# Altium schematic sheet LM-003.SchDoc (part 3 of 3)
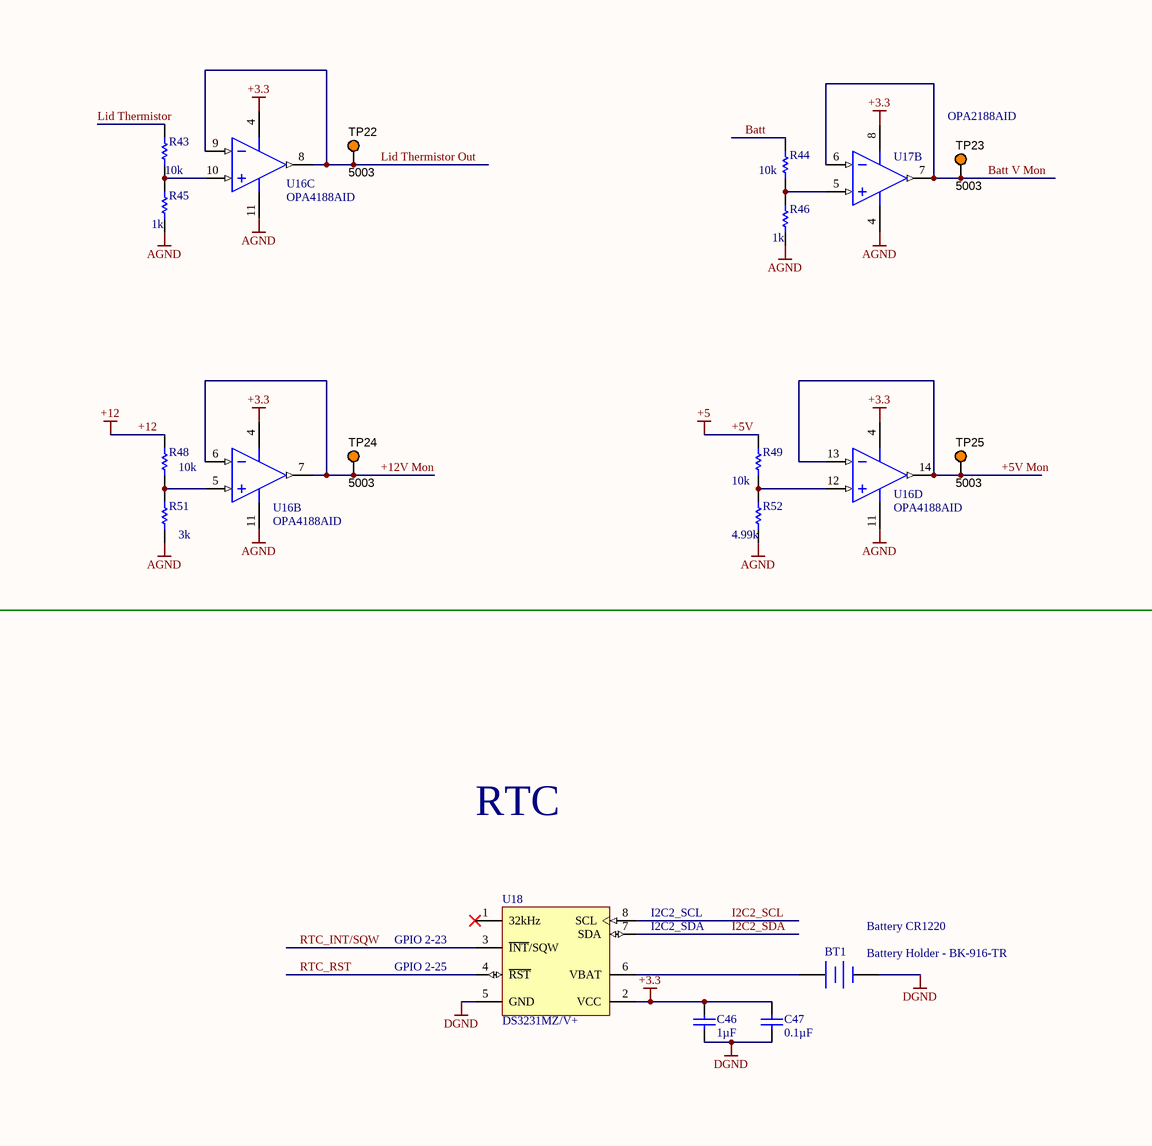
[diagram p10: LM-003.SchDoc, bottom right]

## Library data of the parts (continued)
  R4 R26 R34: Stock 1: 407603
  R15-R18 R20: Stock 1: 406953
R2 = CMP-1013-00017-1: Manufacturer: Vishay Dale; Manufacturer Part Number: CRCW08051K00FKTA; Power (Watts): 0.125W, 1/8W; Temperature Coefficient: ±100ppm/°C; Supplier 1: Digi-Key; Supplier Part Number 1: 541-1.00KAWDKR-ND; RoHS: RoHS non-compliant; Category: Resistors; Stock 1: 57884; Pricing 1: 1=0.14, 10=0.129, 100=0.0496, 1000=0.02183, 2500=0.01885 (USD); Packaging: Digi-Reel®; Part Status: Active; Tolerance: ±1%; Composition: Thick Film; Features: Automotive AEC-Q200; Operating Temperature: -55°C ~ 155°C; Package / Case: 0805 (2012 Metric); Supplier Device Package: 0805; Size / Dimension: 0.079" L x 0.049" W (2.00mm x 1.25mm); Height - Seated (Max): 0.020" (0.50mm); Failure Rate: -; ComponentLink1URL: http://www.vishay.com/docs/20008/dcrcw.pdf; ComponentLink1Description: http://www.vishay.com/docs/20008/dcrcw.pdf
R3 = CMP-1013-00393-1: RES 2K OHM 0.6W 0.1% RADIAL; Manufacturer: Vishay Foil Resistors (Division of Vishay Precision Group); Manufacturer Part Number: Y57872K00000B0L; Temperature Coefficient: ±1ppm/°C; Supplier 1: Digi-Key; Supplier Part Number 1: Y57872K00000B0L-ND; RoHS: RoHS non-compliant; Category: Resistors; Stock 1: 0; Pricing 1: 500=12.12526 (USD); Packaging: Bulk; Part Status: Active; Resistance (Ohms): 2k; Tolerance: ±0.1%; Power (Watts): 0.6W; Composition: Metal Foil; Features: Moisture Resistant, Non-Inductive; Operating Temperature: -55°C ~ 125°C; Package / Case: Radial; Supplier Device Package: -; Size / Dimension: 0.435" L x 0.185" W (11.05mm x 4.70mm); Height - Seated (Max): 0.430" (10.92mm); Failure Rate: -; ComponentLink1URL: http://www.vishaypg.com/docs/63004/vh.pdf; ComponentLink1Description: http://www.vishaypg.com/docs/63004/vh.pdf
R5 = CMP-1013-00017-1: Manufacturer: Vishay Dale; Manufacturer Part Number: CRCW0805280KFKEA; Power (Watts): 0.125W, 1/8W; Temperature Coefficient: ±100ppm/°C; Supplier 1: Digi-Key; Supplier Part Number 1: 541-280KCDKR-ND; RoHS: RoHS Compliant; Category: Resistors; Stock 1: 14771; Pricing 1: 1=0.1, 10=0.044, 100=0.0178, 1000=0.00802, 2500=0.00696 (USD); Packaging: Digi-Reel®; Part Status: Active; Tolerance: ±1%; Composition: Thick Film; Features: Automotive AEC-Q200; Operating Temperature: -55°C ~ 155°C; Package / Case: 0805 (2012 Metric); Supplier Device Package: 0805; Size / Dimension: 0.079" L x 0.049" W (2.00mm x 1.25mm); Height - Seated (Max): 0.020" (0.50mm); Failure Rate: -; ComponentLink1URL: http://www.vishay.com/docs/20035/dcrcwe3.pdf; ComponentLink1Description: http://www.vishay.com/docs/20035/dcrcwe3.pdf
R6-R8 = CMP-1013-00017-1: Manufacturer: Vishay Dale; Manufacturer Part Number: CRCW080510K0FKTA; Power (Watts): 0.125W, 1/8W; Temperature Coefficient: ±100ppm/°C; Supplier 1: Digi-Key; Supplier Part Number 1: 541-3016-6-ND; RoHS: RoHS non-compliant; Category: Resistors; Stock 1: 5348; Pricing 1: 1=0.14, 10=0.129, 100=0.0496, 1000=0.02183, 2500=0.01885 (USD); Packaging: Digi-Reel®; Part Status: Active; Tolerance: ±1%; Composition: Thick Film; Features: Automotive AEC-Q200; Operating Temperature: -55°C ~ 155°C; Package / Case: 0805 (2012 Metric); Supplier Device Package: 0805; Size / Dimension: 0.079" L x 0.049" W (2.00mm x 1.25mm); Height - Seated (Max): 0.020" (0.50mm); Failure Rate: -; ComponentLink1URL: http://www.vishay.com/docs/20008/dcrcw.pdf; ComponentLink1Description: http://www.vishay.com/docs/20008/dcrcw.pdf
R9 = CMP-1013-00017-1: Manufacturer: Vishay Dale; Manufacturer Part Number: CRCW0805300KFKEA; Power (Watts): 0.125W, 1/8W; Temperature Coefficient: ±100ppm/°C; Supplier 1: Digi-Key; Supplier Part Number 1: 541-300KCDKR-ND; RoHS: RoHS Compliant; Category: Resistors; Stock 1: 22918; Pricing 1: 1=0.1, 10=0.044, 100=0.0178, 1000=0.00802, 2500=0.00696 (USD); Packaging: Digi-Reel®; Part Status: Active; Tolerance: ±1%; Composition: Thick Film; Features: Automotive AEC-Q200; Operating Temperature: -55°C ~ 155°C; Package / Case: 0805 (2012 Metric); Supplier Device Package: 0805; Size / Dimension: 0.079" L x 0.049" W (2.00mm x 1.25mm); Height - Seated (Max): 0.020" (0.50mm); Failure Rate: -; ComponentLink1URL: http://www.vishay.com/docs/20035/dcrcwe3.pdf; ComponentLink1Description: http://www.vishay.com/docs/20035/dcrcwe3.pdf
R10 = CMP-1013-00017-1: Manufacturer: Vishay Dale; Manufacturer Part Number: CRCW0805100KFKEAHP; Power (Watts): 0.5W, 1/2W; Temperature Coefficient: ±100ppm/°C; Supplier 1: Digi-Key; Supplier Part Number 1: 541-100KTDKR-ND; RoHS: RoHS Compliant; Category: Resistors; Stock 1: 1548; Pricing 1: 1=0.28, 10=0.233, 100=0.0911, 1000=0.03812, 2500=0.03494 (USD); Packaging: Digi-Reel®; Part Status: Active; Tolerance: ±1%; Composition: Thick Film; Features: Automotive AEC-Q200, Pulse Withstanding; Operating Temperature: -55°C ~ 155°C; Package / Case: 0805 (2012 Metric); Supplier Device Package: 0805; Size / Dimension: 0.079" L x 0.049" W (2.00mm x 1.25mm); Height - Seated (Max): 0.020" (0.50mm); Failure Rate: -; ComponentLink1URL: http://www.vishay.com/docs/20043/crcwhpe3.pdf; ComponentLink1Description: http://www.vishay.com/docs/20043/crcwhpe3.pdf
R11 = CMP-1013-00017-1: Manufacturer: Vishay Dale; Manufacturer Part Number: CRCW080518K2FKEA; Power (Watts): 0.125W, 1/8W; Temperature Coefficient: ±100ppm/°C; Supplier 1: Digi-Key; Supplier Part Number 1: 541-18.2KCDKR-ND; RoHS: RoHS Compliant; Category: Resistors; Stock 1: 12440; Pricing 1: 1=0.1, 10=0.044, 100=0.0178, 1000=0.00802, 2500=0.00696 (USD); Packaging: Digi-Reel®; Part Status: Active; Tolerance: ±1%; Composition: Thick Film; Features: Automotive AEC-Q200; Operating Temperature: -55°C ~ 155°C; Package / Case: 0805 (2012 Metric); Supplier Device Package: 0805; Size / Dimension: 0.079" L x 0.049" W (2.00mm x 1.25mm); Height - Seated (Max): 0.020" (0.50mm); Failure Rate: -; ComponentLink1URL: http://www.vishay.com/docs/20035/dcrcwe3.pdf; ComponentLink1Description: http://www.vishay.com/docs/20035/dcrcwe3.pdf
R12 = CMP-1013-00017-1: Manufacturer: Vishay Dale; Manufacturer Part Number: CRCW08054K70FKEA; Power (Watts): 0.125W, 1/8W; Temperature Coefficient: ±100ppm/°C; Supplier 1: Digi-Key; Supplier Part Number 1: 541-4.70KCDKR-ND; RoHS: RoHS Compliant; Category: Resistors; Stock 1: 0; Pricing 1: 1=0.1, 10=0.044, 100=0.0178, 1000=0.00802, 2500=0.00696 (USD); Packaging: Digi-Reel®; Part Status: Active; Tolerance: ±1%; Composition: Thick Film; Features: Automotive AEC-Q200; Operating Temperature: -55°C ~ 155°C; Package / Case: 0805 (2012 Metric); Supplier Device Package: 0805; Size / Dimension: 0.079" L x 0.049" W (2.00mm x 1.25mm); Height - Seated (Max): 0.020" (0.50mm); Failure Rate: -; ComponentLink1URL: http://www.vishay.com/docs/20035/dcrcwe3.pdf; ComponentLink1Description: http://www.vishay.com/docs/20035/dcrcwe3.pdf
R13 = CMP-1013-00017-1: Manufacturer: Vishay Dale; Manufacturer Part Number: CRCW0805511KFKEA; Power (Watts): 0.125W, 1/8W; Temperature Coefficient: ±100ppm/°C; Supplier 1: Digi-Key; Supplier Part Number 1: 541-511KCDKR-ND; RoHS: RoHS Compliant; Category: Resistors; Stock 1: 39; Pricing 1: 1=0.1, 10=0.044, 100=0.0178, 1000=0.00802, 2500=0.00696 (USD); Packaging: Digi-Reel®; Part Status: Active; Tolerance: ±1%; Composition: Thick Film; Features: Automotive AEC-Q200; Operating Temperature: -55°C ~ 155°C; Package / Case: 0805 (2012 Metric); Supplier Device Package: 0805; Size / Dimension: 0.079" L x 0.049" W (2.00mm x 1.25mm); Height - Seated (Max): 0.020" (0.50mm); Failure Rate: -; ComponentLink1URL: http://www.vishay.com/docs/20035/dcrcwe3.pdf; ComponentLink1Description: http://www.vishay.com/docs/20035/dcrcwe3.pdf
R14 = CMP-1013-00017-1: Manufacturer: Vishay Dale; Manufacturer Part Number: CRCW080533K0FKEAHP; Power (Watts): 0.5W, 1/2W; Temperature Coefficient: ±100ppm/°C; Supplier 1: Digi-Key; Supplier Part Number 1: 541-33.0KTDKR-ND; RoHS: RoHS Compliant; Category: Resistors; Stock 1: 4835; Pricing 1: 1=0.28, 10=0.233, 100=0.0911, 1000=0.03812, 2500=0.03494 (USD); Packaging: Digi-Reel®; Part Status: Active; Tolerance: ±1%; Composition: Thick Film; Features: Automotive AEC-Q200, Pulse Withstanding; Operating Temperature: -55°C ~ 155°C; Package / Case: 0805 (2012 Metric); Supplier Device Package: 0805; Size / Dimension: 0.079" L x 0.049" W (2.00mm x 1.25mm); Height - Seated (Max): 0.020" (0.50mm); Failure Rate: -; ComponentLink1URL: http://www.vishay.com/docs/20043/crcwhpe3.pdf; ComponentLink1Description: http://www.vishay.com/docs/20043/crcwhpe3.pdf
R19 = CMP-1013-00017-1: Manufacturer: Vishay; Manufacturer Part Number: CRCW0805100KFKEA; Temperature Coefficient: 100ppm/°C; Power Rating: 125mW; Voltage Rating: 150V; Supplier 1: Avnet; Supplier Part Number 1: CRCW0805100KFKEA/BKN; Stock 1: 1317; Pricing 1: 1=0.1, 10=0.049, 25=0.042, 50=0.035, 100=0.028 (USD); Mount: Surface Mount; Case/Package: 0805; Number of Pins: 2; Weight: 0.000194oz; Contact Plating: Tin; Case Code (Imperial): 0805; Case Code (Metric): 2012; Min Operating Temperature: -55°C; Max Operating Temperature: 155°C; Tolerance: 1%; Composition: Thick Film; Termination: SMD/SMT; Packaging: Tape and Reel; Package Quantity: 5000; Military Standard: Not; Voltage Rating (DC): 150V; Length: 2mm; Height: 0.45mm; Width: 1.25mm; Depth: 1.25mm; Radiation Hardening: No; Lead Free: Lead Free; REACH SVHC: Unknown; ComponentLink1URL: https://datasheet.ciiva.com/11809/0900766b80d98b26-11809057.pdf; ComponentLink1Description: https://datasheet.ciiva.com/11809/0900766b80d98b26-11809057.pdf; ComponentLink2URL: https://datasheet.ciiva.com/7777/1697337-7777349.pdf; ComponentLink2Description: https://datasheet.ciiva.com/7777/1697337-7777349.pdf; ComponentLink3URL: https://datasheet.ciiva.com/3258/dcrcwe3-3258006.pdf; ComponentLink3Description: https://datasheet.ciiva.com/3258/dcrcwe3-3258006.pdf; ComponentLink4URL: https://datasheet.ciiva.com/16754/70201119-16754822.pdf; ComponentLink4Description: https://datasheet.ciiva.com/16754/70201119-16754822.pdf; ComponentLink5URL: https://datasheet.ciiva.com/8337/dcrcwe3-8337738.pdf; ComponentLink5Description: https://datasheet.ciiva.com/8337/dcrcwe3-8337738.pdf; ComponentLink6URL: https://datasheet.ciiva.com/16341/dcrcwe3-16341530.pdf; ComponentLink6Description: https://datasheet.ciiva.com/16341/dcrcwe3-16341530.pdf; ComponentLink7URL: https://datasheet.ciiva.com/16852/dcrcwe3-16852810.pdf; ComponentLink7Description: https://datasheet.ciiva.com/16852/dcrcwe3-16852810.pdf; ComponentLink8URL: https://datasheet.ciiva.com/16720/70201119-16720891.pdf; ComponentLink8Description: https://datasheet.ciiva.com/16720/70201119-16720891.pdf; ComponentLink9URL: https://datasheet.ciiva.com/7777/1720486-7777565.pdf; ComponentLink9Description: https://datasheet.ciiva.com/7777/1720486-7777565.pdf
R21 R22 = CMP-1013-00574-1: Manufacturer: Vishay Dale; Manufacturer Part Number: CRCW08054K70FKEA; Power (Watts): 0.125W, 1/8W; Temperature Coefficient: ±100ppm/°C; Supplier 1: Digi-Key; Supplier Part Number 1: 541-4.70KCDKR-ND; RoHS: RoHS Compliant; Category: Resistors; Stock 1: 0; Pricing 1: 1=0.1, 10=0.044, 100=0.0178, 1000=0.00802, 2500=0.00696 (USD); Packaging: Digi-Reel®; Part Status: Active; Tolerance: ±1%; Composition: Thick Film; Features: Automotive AEC-Q200; Operating Temperature: -55°C ~ 155°C; Package / Case: 0805 (2012 Metric); Supplier Device Package: 0805; Size / Dimension: 0.079" L x 0.049" W (2.00mm x 1.25mm); Height - Seated (Max): 0.020" (0.50mm); Failure Rate: -; ComponentLink1URL: http://www.vishay.com/docs/20035/dcrcwe3.pdf; ComponentLink1Description: http://www.vishay.com/docs/20035/dcrcwe3.pdf
R23 R30 = CMP-1013-00606-1: Manufacturer: Vishay Dale; Manufacturer Part Number: CRCW08053K90JNEA; Power (Watts): 0.125W, 1/8W; Temperature Coefficient: ±200ppm/°C; Supplier 1: Digi-Key; Supplier Part Number 1: 541-3.9KADKR-ND; RoHS: RoHS Compliant; Category: Resistors; Stock 1: 20963; Pricing 1: 1=0.1, 10=0.028, 100=0.0114, 1000=0.00513, 2500=0.00445 (USD); Packaging: Digi-Reel®; Part Status: Active; Tolerance: ±5%; Composition: Thick Film; Features: Automotive AEC-Q200; Operating Temperature: -55°C ~ 155°C; Package / Case: 0805 (2012 Metric); Supplier Device Package: 0805; Size / Dimension: 0.079" L x 0.049" W (2.00mm x 1.25mm); Height - Seated (Max): 0.020" (0.50mm); Failure Rate: -; ComponentLink1URL: http://www.vishay.com/docs/20035/dcrcwe3.pdf; ComponentLink1Description: http://www.vishay.com/docs/20035/dcrcwe3.pdf
R24 R50 R55 R58 R61 R63 R64 = CMP-1013-00606-1: 6K98 0.125W 1% 0805 (2012 Metric)  SMD; Manufacturer: Vishay Dale; Manufacturer Part Number: CRCW08056K98FKEA; Power (Watts): 0.125W, 1/8W; Temperature Coefficient: ±100ppm/°C; Supplier 1: Digi-Key; Supplier Part Number 1: 541-6.98KCCT-ND; RoHS: RoHS Compliant; Category: Resistors; Stock 1: 34245; Pricing 1: 1=0.1, 10=0.044, 100=0.0178, 1000=0.00802, 2500=0.00696 (USD); Packaging: Cut Tape (CT); Part Status: Active; Tolerance: ±1%; Composition: Thick Film; Features: Automotive AEC-Q200; Operating Temperature: -55°C ~ 155°C; Package / Case: 0805 (2012 Metric); Supplier Device Package: 0805; Size / Dimension: 0.079" L x 0.049" W (2.00mm x 1.25mm); Height - Seated (Max): 0.020" (0.50mm); Failure Rate: -; ComponentLink1URL: http://www.vishay.com/docs/20035/dcrcwe3.pdf; ComponentLink1Description: http://www.vishay.com/docs/20035/dcrcwe3.pdf
R25 R29 = CMP-1013-00606-1: Manufacturer: Vishay Dale; Manufacturer Part Number: CRCW08057K50FKEA; Power (Watts): 0.125W, 1/8W; Temperature Coefficient: ±100ppm/°C; Supplier 1: Digi-Key; Supplier Part Number 1: 541-7.50KCDKR-ND; RoHS: RoHS Compliant; Category: Resistors; Stock 1: 0; Pricing 1: 1=0.1, 10=0.044, 100=0.0178, 1000=0.00802, 2500=0.00696 (USD); Packaging: Digi-Reel®; Part Status: Active; Tolerance: ±1%; Composition: Thick Film; Features: Automotive AEC-Q200; Operating Temperature: -55°C ~ 155°C; Package / Case: 0805 (2012 Metric); Supplier Device Package: 0805; Size / Dimension: 0.079" L x 0.049" W (2.00mm x 1.25mm); Height - Seated (Max): 0.020" (0.50mm); Failure Rate: -; ComponentLink1URL: http://www.vishay.com/docs/20035/dcrcwe3.pdf; ComponentLink1Description: http://www.vishay.com/docs/20035/dcrcwe3.pdf
R27 = CMP-1013-00017-1: RES SMD 0.0 OHM JUMPER 1/8W 0805; Manufacturer: Vishay Dale; Manufacturer Part Number: CRCW08050000Z0EA; Resistance (Ohms): 0.0; Power (Watts): 0.125W, 1/8W; Supplier 1: Digi-Key; Supplier Part Number 1: 541-0.0ADKR-ND; RoHS: RoHS Compliant; Category: Resistors; Stock 1: 407603; Pricing 1: 1=0.1, 10=0.026, 25=0.0184, 50=0.014, 100=0.0104, 250=0.00792, 500=0.00634, 1000=0.00466 (USD); Packaging: Digi-Reel®; Part Status: Active; Tolerance: Jumper; Composition: Thick Film; Features: Automotive AEC-Q200; Temperature Coefficient: -; Operating Temperature: -55°C ~ 155°C; Package / Case: 0805 (2012 Metric); Supplier Device Package: 0805; Size / Dimension: 0.079" L x 0.049" W (2.00mm x 1.25mm); Height - Seated (Max): 0.020" (0.50mm); Failure Rate: -; ComponentLink1URL: http://www.vishay.com/docs/20035/dcrcwe3.pdf; ComponentLink1Description: http://www.vishay.com/docs/20035/dcrcwe3.pdf
R28 = RES1, CENTER TAP: TRIMMER 5K OHM 0.25W PC PIN; Manufacturer 1: Vishay Foil Resistors (Division of Vishay Precision Group); Manufacturer Part Number 1: Y00535K00000J0L; Category 1: Potentiometers, Variable Resistors; Power (Watts): 0.25W, 1/4W; Tolerance: ±5%; Number of Turns: 21; Adjustment Type: Side Adjustment; Resistive Material: Metal Foil; Supplier 1: Digi-Key; Supplier Part Number 1: 804-1020-ND; RoHS 1: RoHS Compliant; Description 1: TRIMMER 5K OHM 0.25W PC PIN; Stock 1: 679; Pricing 1: 1=34.42, 10=32.265, 25=26.5292, 50=22.944, 100=22.227, 250=20.793, 500=19.2156 (USD); Packaging: Bulk; Part Status: Active; Resistance (Ohms): 5k; Mounting Type: Through Hole; Termination Style: PC Pins; Size / Dimension: Rectangular - 0.250" x 0.175" Face x 0.250" L (6.35mm x 4.45mm x 6.35mm); ComponentLink1URL: http://www.vishaypg.com/docs/63053/1240.pdf; ComponentLink1Description: http://www.vishaypg.com/docs/63053/1240.pdf
R31 R32 = CMP-1013-00606-1: Manufacturer: Vishay Dale; Manufacturer Part Number: CRCW08051M00FKEA; Power (Watts): 0.125W, 1/8W; Temperature Coefficient: ±100ppm/°C; Supplier 1: Digi-Key; Supplier Part Number 1: 541-1.00MCDKR-ND; RoHS: RoHS Compliant; Category: Resistors; Stock 1: 44065; Pricing 1: 1=0.1, 10=0.044, 100=0.0178, 1000=0.00802, 2500=0.00696 (USD); Packaging: Digi-Reel®; Part Status: Active; Tolerance: ±1%; Composition: Thick Film; Features: Automotive AEC-Q200; Operating Temperature: -55°C ~ 155°C; Package / Case: 0805 (2012 Metric); Supplier Device Package: 0805; Size / Dimension: 0.079" L x 0.049" W (2.00mm x 1.25mm); Height - Seated (Max): 0.020" (0.50mm); Failure Rate: -; ComponentLink1URL: http://www.vishay.com/docs/20035/dcrcwe3.pdf; ComponentLink1Description: http://www.vishay.com/docs/20035/dcrcwe3.pdf
R33 = CMP-1013-00133-1: 300K 0.125W 5% 0805 (2012 Metric)  SMD; Manufacturer: Vishay Dale; Manufacturer Part Number: CRCW0805300RFKEA; Tolerance: ±1%; Power (Watts): 0.125W, 1/8W; Temperature Coefficient: ±100ppm/°C; Supplier 1: Digi-Key; Supplier Part Number 1: 541-300CCT-ND; RoHS: RoHS Compliant; Category: Resistors; Stock 1: 79765; Pricing 1: 1=0.1, 10=0.044, 100=0.0178, 1000=0.00802, 2500=0.00696 (USD); Packaging: Cut Tape (CT); Part Status: Active; Composition: Thick Film; Features: Automotive AEC-Q200; Operating Temperature: -55°C ~ 155°C; Package / Case: 0805 (2012 Metric); Supplier Device Package: 0805; Size / Dimension: 0.079" L x 0.049" W (2.00mm x 1.25mm); Height - Seated (Max): 0.020" (0.50mm); Failure Rate: -; ComponentLink1URL: http://www.vishay.com/docs/20035/dcrcwe3.pdf; ComponentLink1Description: http://www.vishay.com/docs/20035/dcrcwe3.pdf
R35 = CMP-1013-00017-1: Manufacturer: Vishay; Manufacturer Part Number: CRCW08050000Z0EA; Power Rating: 125mW; Voltage Rating: 150V; Tolerance: 1%; Temperature Coefficient: 100ppm/°C; Supplier 1: Digi-Key; Supplier Part Number 1: 541-0.0ADKR-ND; Stock 1: 415251; Pricing 1: 1=0.1, 10=0.026, 25=0.0184, 50=0.014, 100=0.0104, 250=0.0079, 500=0.0063, 1000=0.0047 (USD); Case/Package: 0805; Weight: 0.000194oz; Contact Plating: Tin,Lead; Case Code (Imperial): 0805; Case Code (Metric): 2012; Min Operating Temperature: -55°C; Max Operating Temperature: 155°C; Composition: Thick Film; Termination: SMD/SMT; Packaging: Tape and Reel; Package Quantity: 1; Number of Terminations: 2; Military Standard: Not; Max Power Dissipation: 125mW; Voltage Rating (DC): 150V; Length: 2mm; Height: 0.45mm; Width: 1.25mm; Depth: 1.25mm; Radiation Hardening: No; Lead Free: Lead Free; REACH SVHC: Unknown; ComponentLink1URL: https://datasheet.ciiva.com/16883/dcrcwe3-16883622.pdf; ComponentLink1Description: https://datasheet.ciiva.com/16883/dcrcwe3-16883622.pdf; ComponentLink2URL: https://datasheet.ciiva.com/26314/fld-crcw-e3-data-en-26314630.pdf; ComponentLink2Description: https://datasheet.ciiva.com/26314/fld-crcw-e3-data-en-26314630.pdf; ComponentLink3URL: https://datasheet.ciiva.com/5543/dcrcwe3-109170-5543096.pdf; ComponentLink3Description: https://datasheet.ciiva.com/5543/dcrcwe3-109170-5543096.pdf; ComponentLink4URL: https://datasheet.ciiva.com/11811/0900766b80d98b26-11811304.pdf; ComponentLink4Description: https://datasheet.ciiva.com/11811/0900766b80d98b26-11811304.pdf; ComponentLink5URL: https://datasheet.ciiva.com/16389/dcrcwe3-16389338.pdf; ComponentLink5Description: https://datasheet.ciiva.com/16389/dcrcwe3-16389338.pdf; ComponentLink6URL: https://datasheet.ciiva.com/16719/70201119-16719706.pdf; ComponentLink6Description: https://datasheet.ciiva.com/16719/70201119-16719706.pdf; ComponentLink7URL: https://datasheet.ciiva.com/2463/dcrcwe3-2463037.pdf; ComponentLink7Description: https://datasheet.ciiva.com/2463/dcrcwe3-2463037.pdf; ComponentLink8URL: https://datasheet.ciiva.com/7841/1697337-7841629.pdf; ComponentLink8Description: https://datasheet.ciiva.com/7841/1697337-7841629.pdf; ComponentLink9URL: https://datasheet.ciiva.com/2463/dcrcwe3-2463038.pdf; ComponentLink9Description: https://datasheet.ciiva.com/2463/dcrcwe3-2463038.pdf; ComponentLink10URL: https://datasheet.ciiva.com/2463/dcrcwe3-2463039.pdf; ComponentLink10Description: https://datasheet.ciiva.com/2463/dcrcwe3-2463039.pdf; ComponentLink11URL: https://datasheet.ciiva.com/7841/1720486-7841839.pdf; ComponentLink11Description: https://datasheet.ciiva.com/7841/1720486-7841839.pdf
R36 = CMP-1013-00017-1: RES SMD 0.0 OHM JUMPER 1/8W 0805; Manufacturer: Vishay; Manufacturer Part Number: CRCW08050000Z0EA; Resistance: 0; Power Rating: 125mW; Voltage Rating: 150V; Tolerance: 1%; Temperature Coefficient: 100ppm/°C; Supplier 1: Digi-Key; Supplier Part Number 1: 541-0.0ADKR-ND; Stock 1: 415251; Pricing 1: 1=0.1, 10=0.026, 25=0.0184, 50=0.014, 100=0.0104, 250=0.0079, 500=0.0063, 1000=0.0047 (USD); Case/Package: 0805; Weight: 0.000194oz; Contact Plating: Tin,Lead; Case Code (Imperial): 0805; Case Code (Metric): 2012; Min Operating Temperature: -55°C; Max Operating Temperature: 155°C; Composition: Thick Film; Termination: SMD/SMT; Packaging: Tape and Reel; Package Quantity: 1; Number of Terminations: 2; Military Standard: Not; Max Power Dissipation: 125mW; Voltage Rating (DC): 150V; Length: 2mm; Height: 0.45mm; Width: 1.25mm; Depth: 1.25mm; Radiation Hardening: No; Lead Free: Lead Free; REACH SVHC: Unknown; ComponentLink1URL: https://datasheet.ciiva.com/16883/dcrcwe3-16883622.pdf; ComponentLink1Description: https://datasheet.ciiva.com/16883/dcrcwe3-16883622.pdf; ComponentLink2URL: https://datasheet.ciiva.com/26314/fld-crcw-e3-data-en-26314630.pdf; ComponentLink2Description: https://datasheet.ciiva.com/26314/fld-crcw-e3-data-en-26314630.pdf; ComponentLink3URL: https://datasheet.ciiva.com/5543/dcrcwe3-109170-5543096.pdf; ComponentLink3Description: https://datasheet.ciiva.com/5543/dcrcwe3-109170-5543096.pdf; ComponentLink4URL: https://datasheet.ciiva.com/11811/0900766b80d98b26-11811304.pdf; ComponentLink4Description: https://datasheet.ciiva.com/11811/0900766b80d98b26-11811304.pdf; ComponentLink5URL: https://datasheet.ciiva.com/16389/dcrcwe3-16389338.pdf; ComponentLink5Description: https://datasheet.ciiva.com/16389/dcrcwe3-16389338.pdf; ComponentLink6URL: https://datasheet.ciiva.com/16719/70201119-16719706.pdf; ComponentLink6Description: https://datasheet.ciiva.com/16719/70201119-16719706.pdf; ComponentLink7URL: https://datasheet.ciiva.com/2463/dcrcwe3-2463037.pdf; ComponentLink7Description: https://datasheet.ciiva.com/2463/dcrcwe3-2463037.pdf; ComponentLink8URL: https://datasheet.ciiva.com/7841/1697337-7841629.pdf; ComponentLink8Description: https://datasheet.ciiva.com/7841/1697337-7841629.pdf; ComponentLink9URL: https://datasheet.ciiva.com/2463/dcrcwe3-2463038.pdf; ComponentLink9Description: https://datasheet.ciiva.com/2463/dcrcwe3-2463038.pdf; ComponentLink10URL: https://datasheet.ciiva.com/2463/dcrcwe3-2463039.pdf; ComponentLink10Description: https://datasheet.ciiva.com/2463/dcrcwe3-2463039.pdf; ComponentLink11URL: https://datasheet.ciiva.com/7841/1720486-7841839.pdf; ComponentLink11Description: https://datasheet.ciiva.com/7841/1720486-7841839.pdf
R37 R43 R44 R48 R49 = CMP-1013-00393-1: Manufacturer: Vishay Dale; Manufacturer Part Number: CRCW080510K0FKTA; Power (Watts): 0.125W, 1/8W; Temperature Coefficient: ±100ppm/°C; Supplier 1: Digi-Key; Supplier Part Number 1: 541-3016-6-ND; RoHS: RoHS non-compliant; Category: Resistors; Stock 1: 4898; Pricing 1: 1=0.14, 10=0.129, 100=0.0496, 1000=0.02183, 2500=0.01885 (USD); Packaging: Digi-Reel®; Part Status: Active; Tolerance: ±1%; Composition: Thick Film; Features: Automotive AEC-Q200; Operating Temperature: -55°C ~ 155°C; Package / Case: 0805 (2012 Metric); Supplier Device Package: 0805; Size / Dimension: 0.079" L x 0.049" W (2.00mm x 1.25mm); Height - Seated (Max): 0.020" (0.50mm); Failure Rate: -; ComponentLink1URL: http://www.vishay.com/docs/20008/dcrcw.pdf; ComponentLink1Description: http://www.vishay.com/docs/20008/dcrcw.pdf
R38 = CMP-1013-00017-1: Manufacturer: Vishay Dale; Manufacturer Part Number: CRCW0805383RFKEA; Power (Watts): 0.125W, 1/8W; Temperature Coefficient: ±100ppm/°C; Supplier 1: Digi-Key; Supplier Part Number 1: 541-383CDKR-ND; RoHS: RoHS Compliant; Category: Resistors; Stock 1: 21887; Pricing 1: 1=0.1, 10=0.044, 100=0.0178, 1000=0.00802, 2500=0.00696 (USD); Packaging: Digi-Reel®; Part Status: Active; Tolerance: ±1%; Composition: Thick Film; Features: Automotive AEC-Q200; Operating Temperature: -55°C ~ 155°C; Package / Case: 0805 (2012 Metric); Supplier Device Package: 0805; Size / Dimension: 0.079" L x 0.049" W (2.00mm x 1.25mm); Height - Seated (Max): 0.020" (0.50mm); Failure Rate: -; ComponentLink1URL: http://www.vishay.com/docs/20035/dcrcwe3.pdf; ComponentLink1Description: http://www.vishay.com/docs/20035/dcrcwe3.pdf
R39 R45 R46 = CMP-1013-00393-1: Manufacturer: Vishay Dale; Manufacturer Part Number: CRCW08051K00FKEA; Power (Watts): 0.125W, 1/8W; Temperature Coefficient: ±100ppm/°C; Supplier 1: Digi-Key; Supplier Part Number 1: 541-1.00KCDKR-ND; RoHS: RoHS Compliant; Category: Resistors; Stock 1: 34392; Pricing 1: 1=0.1, 10=0.044, 100=0.0178, 1000=0.00802, 2500=0.00696 (USD); Packaging: Digi-Reel®; Part Status: Active; Tolerance: ±1%; Composition: Thick Film; Features: Automotive AEC-Q200; Operating Temperature: -55°C ~ 155°C; Package / Case: 0805 (2012 Metric); Supplier Device Package: 0805; Size / Dimension: 0.079" L x 0.049" W (2.00mm x 1.25mm); Height - Seated (Max): 0.020" (0.50mm); Failure Rate: -; ComponentLink1URL: http://www.vishay.com/docs/20035/dcrcwe3.pdf; ComponentLink1Description: http://www.vishay.com/docs/20035/dcrcwe3.pdf
R40 = CMP-1013-00017-1: RES SMD 1K OHM 1% 1/2W 0805; Manufacturer: Vishay Dale; Manufacturer Part Number: CRCW08051K00FKEAHP; Power (Watts): 0.5W, 1/2W; Temperature Coefficient: ±100ppm/°C; Supplier 1: Digi-Key; Supplier Part Number 1: 541-1.00KTDKR-ND; RoHS: RoHS Compliant; Category: Resistors; Stock 1: 64012; Pricing 1: 1=0.28, 10=0.233, 100=0.0911, 1000=0.03812, 2500=0.03494 (USD); Packaging: Digi-Reel®; Part Status: Active; Tolerance: ±1%; Composition: Thick Film; Features: Automotive AEC-Q200, Pulse Withstanding; Operating Temperature: -55°C ~ 155°C; Package / Case: 0805 (2012 Metric); Supplier Device Package: 0805; Size / Dimension: 0.079" L x 0.049" W (2.00mm x 1.25mm); Height - Seated (Max): 0.020" (0.50mm); Failure Rate: -; ComponentLink1URL: http://www.vishay.com/docs/20043/crcwhpe3.pdf; ComponentLink1Description: http://www.vishay.com/docs/20043/crcwhpe3.pdf
R41 R42 = CMP-1013-00393-1: Manufacturer: Vishay Dale; Manufacturer Part Number: CRCW0805100RFKEA; Power (Watts): 0.125W, 1/8W; Temperature Coefficient: ±100ppm/°C; Supplier 1: Digi-Key; Supplier Part Number 1: 541-100CDKR-ND; RoHS: RoHS Compliant; Category: Resistors; Stock 1: 281212; Pricing 1: 1=0.1, 10=0.044, 100=0.0178, 1000=0.00802, 2500=0.00696 (USD); Packaging: Digi-Reel®; Part Status: Active; Tolerance: ±1%; Composition: Thick Film; Features: Automotive AEC-Q200; Operating Temperature: -55°C ~ 155°C; Package / Case: 0805 (2012 Metric); Supplier Device Package: 0805; Size / Dimension: 0.079" L x 0.049" W (2.00mm x 1.25mm); Height - Seated (Max): 0.020" (0.50mm); Failure Rate: -; ComponentLink1URL: http://www.vishay.com/docs/20035/dcrcwe3.pdf; ComponentLink1Description: http://www.vishay.com/docs/20035/dcrcwe3.pdf
R47 R54 R57 R60 R65 = CMP-1013-00393-1: Manufacturer: Vishay Dale; Manufacturer Part Number: CRCW08054K99FKEA; Power (Watts): 0.125W, 1/8W; Temperature Coefficient: ±100ppm/°C; Supplier 1: Digi-Key; Supplier Part Number 1: 541-4.99KCDKR-ND; RoHS: RoHS Compliant; Category: Resistors; Stock 1: 91870; Pricing 1: 1=0.1, 10=0.044, 100=0.0178, 1000=0.00802, 2500=0.00696 (USD); Packaging: Digi-Reel®; Part Status: Active; Tolerance: ±1%; Composition: Thick Film; Features: Automotive AEC-Q200; Operating Temperature: -55°C ~ 155°C; Package / Case: 0805 (2012 Metric); Supplier Device Package: 0805; Size / Dimension: 0.079" L x 0.049" W (2.00mm x 1.25mm); Height - Seated (Max): 0.020" (0.50mm); Failure Rate: -; ComponentLink1URL: http://www.vishay.com/docs/20035/dcrcwe3.pdf; ComponentLink1Description: http://www.vishay.com/docs/20035/dcrcwe3.pdf
R51 = CMP-1013-00393-1: Manufacturer: Vishay Dale; Manufacturer Part Number: CRCW08053K00FKEAHP; Power (Watts): 0.5W, 1/2W; Temperature Coefficient: ±100ppm/°C; Supplier 1: Digi-Key; Supplier Part Number 1: 541-3.00KTDKR-ND; RoHS: RoHS Compliant; Category: Resistors; Stock 1: 4756; Pricing 1: 1=0.28, 10=0.233, 100=0.0911, 1000=0.03812, 2500=0.03494 (USD); Packaging: Digi-Reel®; Part Status: Active; Tolerance: ±1%; Composition: Thick Film; Features: Automotive AEC-Q200, Pulse Withstanding; Operating Temperature: -55°C ~ 155°C; Package / Case: 0805 (2012 Metric); Supplier Device Package: 0805; Size / Dimension: 0.079" L x 0.049" W (2.00mm x 1.25mm); Height - Seated (Max): 0.020" (0.50mm); Failure Rate: -; ComponentLink1URL: http://www.vishay.com/docs/20043/crcwhpe3.pdf; ComponentLink1Description: http://www.vishay.com/docs/20043/crcwhpe3.pdf
R52 = CMP-1013-00393-1: Manufacturer: Vishay Dale; Manufacturer Part Number: CRCW08054K99FKTA; Power (Watts): 0.125W, 1/8W; Temperature Coefficient: ±100ppm/°C; Supplier 1: Digi-Key; Supplier Part Number 1: 541-3030-6-ND; RoHS: RoHS non-compliant; Category: Resistors; Stock 1: 14290; Pricing 1: 1=0.14, 10=0.129, 100=0.0496, 1000=0.02183, 2500=0.01885 (USD); Packaging: Digi-Reel®; Part Status: Active; Tolerance: ±1%; Composition: Thick Film; Features: Automotive AEC-Q200; Operating Temperature: -55°C ~ 155°C; Package / Case: 0805 (2012 Metric); Supplier Device Package: 0805; Size / Dimension: 0.079" L x 0.049" W (2.00mm x 1.25mm); Height - Seated (Max): 0.020" (0.50mm); Failure Rate: -; ComponentLink1URL: http://www.vishay.com/docs/20008/dcrcw.pdf; ComponentLink1Description: http://www.vishay.com/docs/20008/dcrcw.pdf
R53 R56 R59 R62 R66 = CMP-1013-00393-1: Manufacturer: Vishay Dale; Manufacturer Part Number: CRCW080575R0FKEA; Power (Watts): 0.125W, 1/8W; Temperature Coefficient: ±100ppm/°C; Supplier 1: Digi-Key; Supplier Part Number 1: 541-75.0CDKR-ND; RoHS: RoHS Compliant; Category: Resistors; Stock 1: 26396; Pricing 1: 1=0.1, 10=0.044, 100=0.0178, 1000=0.00802, 2500=0.00696 (USD); Packaging: Digi-Reel®; Part Status: Active; Tolerance: ±1%; Composition: Thick Film; Features: Automotive AEC-Q200; Operating Temperature: -55°C ~ 155°C; Package / Case: 0805 (2012 Metric); Supplier Device Package: 0805; Size / Dimension: 0.079" L x 0.049" W (2.00mm x 1.25mm); Height - Seated (Max): 0.020" (0.50mm); Failure Rate: -; ComponentLink1URL: http://www.vishay.com/docs/20035/dcrcwe3.pdf; ComponentLink1Description: http://www.vishay.com/docs/20035/dcrcwe3.pdf
RL1 = Relay-SPDT: RELAY TELECOM SPDT 2A 12V; Manufacturer 1: TE Connectivity Potter & Brumfield Relays; Category 1: Relays; Coil Type: Non Latching; Coil Voltage: 12VDC; Contact Form: SPDT (1 Form C); Switching Voltage: 250VAC, 220VDC - Max; Turn On Voltage (Max): 9 VDC; Turn Off Voltage (Min): 1.2 VDC; Coil Power: 140 mW; Coil Resistance: 1.03 kOhms; Supplier 1: Digi-Key; Supplier Part Number 1: PB1250CT-ND; Manufacturer Part Number 1: 1462042-9; RoHS 1: RoHS Compliant; Description 1: RELAY TELECOM SPDT 2A 12V; Stock 1: 15694; Pricing 1: 1=4.25, 10=3.98, 25=3.5376, 50=3.3608, 100=3.1838, 250=2.94064 (USD); Packaging: Cut Tape (CT); Part Status: Active; Relay Type: Telecom; Features: Sealed - Hermetically; Mounting Type: Surface Mount; Termination Style: Gull Wing; Contact Material: Palladium (Pd), Ruthenium (Ru), Gold (Au); Operating Temperature: -40°C ~ 85°C; ComponentLink1URL: http://www.te.com/commerce/DocumentDelivery/DDEController?Action=srchrtrv&DocNm=1462042-2&DocType=Customer+Drawing&DocLang=English; ComponentLink1Description: http://www.te.com/commerce/DocumentDelivery/DDEController?Action=srchrtrv&DocNm=1462042-2&DocType=Customer+Drawing&DocLang=English
TP1-TP15 TP17-TP25 = CMP-1672-00009-1: Test Point, Orange, 1-Pin THD, RoHS; Peak Reverse Current: 600 uA; Forward Current: 3 A; Max Surge Current: 80 A; Forward Voltage: 1.08 V; Max Operating Temperature: 150 degC; PackageReference: 5003; Pins: 2; ComponentLink2URL: http://keyelco.com/userAssets/file/M65p56.pdf; PackageDescription: 1-Pin Through Hole Device, Dia 2.54 mm; Weight: 0.01 lb; Diameter: 5.3 mm; Mount: Through Hole; Package Quantity: 500; Packaging: Bulk; Min Operating Temperature: -65 degC; ComponentLink1Description: Manufacturer URL; Height: 0.25 inch; ComponentLink1URL: http://www.keyelco.com/; ComponentLink2Description: Datasheet; Width: 0.25 inch; REACH SVHC: No SVHC; RoHSCompliant: true; Radiation Hardening: No; Length: 9.5 mm; DatasheetVersion: Jun-15
TP16 = TESTPOINT A: Manufacturer 1: Keystone Electronics; Manufacturer Part Number 1: 5001; Category 1: Test and Measurement; Plating: Silver; Material - Insulation: Nylon 46, UL 94V-0; Material - Body: Phosphor Bronze; Supplier 1: Digi-Key; Supplier Part Number 1: 36-5001-ND; RoHS 1: RoHS Compliant; Description 1: TEST POINT PC MINI .040"D BLACK; Stock 1: 883882; Pricing 1: 1=0.37, 10=0.316, 50=0.2298, 100=0.2209, 250=0.19832, 500=0.18932, 1000=0.1616, 2500=0.14424, 5000=0.13523 (USD); Packaging: Bulk; Part Status: Active; Type: PC Test Point, Miniature; Mounting Type: 0.040" (1.02mm) Hole Diameter; Color: Black; Size / Dimension: 0.100" Dia x 0.180" L (2.54mm x 4.57mm); Height: -; ComponentLink1URL: http://www.keyelco.com/product-pdf.cfm?p=1310; ComponentLink1Description: http://www.keyelco.com/product-pdf.cfm?p=1310
U1 = BD90GA3WEFJ-E2: IC REG LDO 9V 0.3A 8HTSOP-J; Category 2: Integrated Circuits (ICs); Regulator Topology: Positive Fixed; Current - Output: 300mA; Voltage - Dropout (Typical): 0.6V @ 300mA; Voltage - Input: Up to 14V; Supplier 1: Digi-Key; Supplier Part Number 1: BD90GA3WEFJ-E2DKR-ND; Supplier 2: Digi-Key; Supplier Part Number 2: BD90GA3WEFJ-E2CT-ND; Manufacturer 2: Rohm Semiconductor; Manufacturer Part Number 2: BD90GA3WEFJ-E2; RoHS 2: RoHS Compliant; Description 2: IC REG LDO 9V 0.3A 8HTSOP-J; Stock 2: 4781; Pricing 2: 1=0.69, 10=0.606, 25=0.5364, 100=0.4672, 250=0.40664, 500=0.34608, 1000=0.27686 (USD); Packaging: Cut Tape (CT); Part Status: Active; Voltage - Output: 9V; Current - Limit (Min): -; Operating Temperature: -25°C ~ 85°C; Mounting Type: Surface Mount; Package / Case: 8-SOIC (0.154", 3.90mm Width) Exposed Pad; Supplier Device Package: 8-HTSOP-J; ComponentLink1URL: http://rohmfs.rohm.com/en/products/databook/datasheet/ic/power/linear_regulator/bdxxga3wefj-e.pdf; ComponentLink1Description: http://rohmfs.rohm.com/en/products/databook/datasheet/ic/power/linear_regulator/bdxxga3wefj-e.pdf
U2 = CMP-0491-01698-1: IC REG BOOST ADJ 0.3A TSOT23-6; Manufacturer 1: Linear Technology; Manufacturer Part Number 1: LT3461AES6#TRMPBF; Category 1: Integrated Circuits (ICs); Function: Step-Up; Output Configuration: Positive; Output Type: Adjustable; Number of Outputs: 1; Voltage - Input (Min): 2.5V; Voltage - Input (Max): 16V; Voltage - Output (Min/Fixed): 1.255V; Voltage - Output (Max): 38V; Current - Output: 300mA (Switch); Frequency - Switching: 3MHz; Synchronous Rectifier: No; Supplier 1: Digi-Key; Supplier Part Number 1: LT3461AES6#TRMPBFCT-ND; RoHS 1: RoHS Compliant; Description 1: IC REG BOOST ADJ 0.3A TSOT23-6; Stock 1: 1325; Pricing 1: 1=3.94, 25=3.52, 100=2.4, 250=2.2 (USD); Packaging: Cut Tape (CT); Part Status: Active; Topology: Boost; Operating Temperature: 0°C ~ 70°C (TA); Mounting Type: Surface Mount; Package / Case: SOT-23-6 Thin, TSOT-23-6; Supplier Device Package: TSOT-23-6; ComponentLink1URL: http://www.linear.com/docs/3469; ComponentLink1Description: http://www.linear.com/docs/3469
U3 U5 U16 = OPA4188AID: 0.03 uV/C, Low Noise, Rail-to-Rail Output, Zero-Drift Operational Amplifier, 4 to 36 V, -40 to 125 degC, 14-pin SOIC (D14), Green (RoHS & no Sb/Br); Manufacturer: Texas Instruments; CMRR(Min)(dB): 120; GBW(Typ)(MHz): 2; Iq per channel(Max)(mA): 0.475; Number of Channels: 4; Offset Drift(Typ)(uV/C): 0.03; Packing: TUBE; Rating: Catalog; Slew Rate(Typ)(V/us): 0.8; SubFamily: High Supply Voltage Amplifier (>=30V), Low Noise Amp (<=10nV/rtHz), Low Offset Voltage Amplifier (<=500uV), Low Power Amp (<=500uA), Zero Drift Precision Amplifier; Total Supply Voltage(Max)(+5V is 5, +/-5V is 10): 36; DatasheetVersion: SBOS641B; PackageVersion: 4040047-5/M, 06/2011; PackageReference: D14; PackageDescription: 14-Pin Plastic Small Outline, Body 8.65 x 3.9 mm, Pitch 1.27 mm; Supplier 1: Digi-Key; Supplier Part Number 1: 296-34857-5-ND; Supplier 2: Farnell; Supplier Part Number 2: 2211327; Supplier 3: Newark; Supplier Part Number 3: 44W4374; Supplier 4: Newark; Supplier Part Number 4: 27W9605; Supplier 5: Mouser; Supplier Part Number 5: 595-OPA4188AID; Eco-Plan: Green (RoHS & no Sb/Br); Total Supply Voltage(Min)(+5V is 5, +/-5V is 10): 4; Mounting Technology: Surface Mount; Code_JEDEC: MS-012; PartNumber: OPA4188AID; ComponentLink1Description: Manufacturer URL; ComponentLink1URL: http://www.ti.com/; ComponentLink2Description: Datasheet; ComponentLink2URL: http://www.ti.com/lit/ds/symlink/opa4188.pdf; ComponentLink3Description: Package Specification; ComponentLink3URL: http://www.ti.com/lit/ml/mpds177g/mpds177g.pdf
U4 U14 = CMP-0784-00054-1: Pin Programmable, Precision Voltage Reference, + 2.5 / + 5 / + 7.5 / + 10 Prog V Output, 4.5 to 30 V Supply, Commercial, 8-pin DIP (N-8), Tube; Manufacturer: Analog Devices; Max V Supply (V): 30; Min V Supply (V): 4.5; Ref Out TC (ppm/C): 15; Vout: 2.5V, 5V, 7.5V, 10V; ComponentLink3URL: http:/www.analog.com/static/imported-files/packages/PKG_PDF/PDIP(N)/N_8.pdf; ComponentLink1URL: http://www.analog.com/en/index.html; PartNumber: AD584KNZ; ComponentLink1Description: Manufacturer URL; ComponentLink2Description: Datasheet; PackageDescription: 8-Pin Plastic Dual In-Line Package, Row spacing 7.62 mm, Pitch 2.54 mm; Operating Temp Range: 0 to 70 degC; DatasheetVersion: Rev. C; Code_JEDEC: MS-001; Packing: Tube; ComponentLink3Description: Package Specification; PackageReference: N-8; ComponentLink4Description: URL Link1; Mounting Technology: Through Hole; PackageVersion: 070606-A, 07/2006; ComponentLink4URL: Product URL:http://www.analog.com/en/special-linear-functions/voltage-references/ad584/products/product.html; ComponentLink2URL: http://www.analog.com/static/imported-files/data_sheets/AD584.pdf
U7#1 U7#2 U10#1 U10#2 = CMP-0809-00004-2: Precision, Low Noise, Rail-to-Rail Output, Zero-Drift Operational Amplifier, 4 to 36 V, -40 to 125 degC, 8-pin SOIC (D8), Green (RoHS & no Sb/Br); Manufacturer: Texas Instruments; Iq per channel(Max)(mA): 0.51; SubFamily: Zero Drift Precision Amplifier; Total Supply Voltage(Max)(+5V is 5, +/-5V is 10): 36; CMRR(Min)(dB): 120; Total Supply Voltage(Min)(+5V is 5, +/-5V is 10): 4; Slew Rate(Typ)(V/us): 0.8; GBW(Typ)(MHz): 2; Offset Drift(Typ)(uV/C): 0.03; Number of Channels: 1; Rating: Catalog; Packing: LARGE T&R; ComponentLink2URL: http://www.ti.com/lit/ds/symlink/opa188.pdf; Eco-Plan: Green (RoHS & no Sb/Br); DatasheetVersion: SBOS642A; PartNumber: OPA188AIDR; ComponentLink3Description: Package Specification; PackageDescription: 8-Pin Plastic Small Outline, Body 4.9 x 3.9 mm, Pitch 1.27 mm; Code_JEDEC: MS-012; ComponentLink1Description: Manufacturer URL; PackageReference: D0008A; Mounting Technology: Surface Mount; PackageVersion: 4040047-3/M, 06/2011; ComponentLink3URL: http://www.ti.com/litv/pdf/msoi002j; ComponentLink2Description: Datasheet; ComponentLink1URL: http://www.ti.com/; PartId: 1
U8 = CCG302412S: IC CONV DC-DC 15W DUAL 5V PCB; Manufacturer 1: TDK-Lambda Americas Inc.; Category 1: Power Supplies - Board Mount; Number of Outputs: 2; Voltage - Input (Min): 9V; Voltage - Input (Max): 36V; Voltage - Output 2: -5V; Current - Output (Max): 1.5A, 1.5A; Voltage - Isolation: 1.6kV (1600V); Efficiency: 85%; Supplier 1: Digi-Key; Supplier Part Number 1: 285-1902-ND; Manufacturer Part Number 1: PXB15-24WD05/N; RoHS 1: RoHS Compliant; Description 1: IC CONV DC-DC 15W DUAL 5V PCB; Stock 1: 28; Pricing 1: 1=61.61, 10=59.59 (USD); Packaging: Tube; Part Status: Active; Type: Isolated Module; Voltage - Output 1: 5V; Voltage - Output 3: -; Power (Watts): 15W; Applications: ITE (Commercial); Features: Remote On/Off, OCP, OVP, SCP; Operating Temperature: -40°C ~ 85°C; Mounting Type: Through Hole; Package / Case: 6-DIP Module; Size / Dimension: 1.00" L x 1.00" W x 0.39" H (25.4mm x 25.4mm x 9.9mm); ComponentLink1URL: http://us.tdk-lambda.com/ftp/AppNotes/pxb15w-d_appnote.pdf; ComponentLink1Description: http://us.tdk-lambda.com/ftp/AppNotes/pxb15w-d_appnote.pdf
U9 = MAX1300AEUG: IC ADC 16BIT SRL 115KSPS 24TSSOP; Manufacturer 1: Maxim Integrated; Manufacturer Part Number 1: MAX1300AEUG+; Category 1: Integrated Circuits (ICs); Number of Bits: 16; Sampling Rate (Per Second): 115k; Number of Inputs: 4, 8; Input Type: Differential, Single Ended; Data Interface: SPI; Configuration: MUX-PGA-S/H-ADC; Ratio - S/H:ADC: 1:1; Number of A/D Converters: 1; Architecture: SAR; Reference Type: External, Internal; Voltage - Supply, Analog: 5V; Supplier 2: Mouser; Supplier Part Number 2: 700-MAX1300AEUG+; Supplier 1: Digi-Key; Supplier Part Number 1: MAX1300AEUG+-ND; RoHS 1: RoHS Compliant; Description 1: IC ADC 16BIT SRL 115KSPS 24TSSOP; Stock 1: 1553; Pricing 1: 1=13.94, 10=13.24, 50=13.16 (USD); Packaging: Tube; Part Status: Active; Voltage - Supply, Digital: 5V; Features: PGA; Operating Temperature: -40°C ~ 85°C; Package / Case: 24-TSSOP (0.173", 4.40mm Width); Supplier Device Package: 24-TSSOP; ComponentLink1URL: http://datasheets.maximintegrated.com/en/ds/MAX1300-MAX1301.pdf; ComponentLink1Description: http://datasheets.maximintegrated.com/en/ds/MAX1300-MAX1301.pdf
U11 = LT1763CS8-5#PBF: IC REG LDO 5V 0.5A 8SOIC; Manufacturer 1: Linear Technology; Category 1: Integrated Circuits (ICs); Regulator Topology: Positive Fixed; Current - Output: 500mA; Voltage - Dropout (Typical): 0.3V @ 500mA; Voltage - Input: Up to 20V; Current - Limit (Min): 520mA; Supplier 1: Digi-Key; Supplier Part Number 1: LT1763CS8-5#PBF-ND; Manufacturer Part Number 1: LT1763CS8-5#PBF; RoHS 1: RoHS Compliant; Description 1: IC REG LDO 5V 0.5A 8SOIC; Stock 1: 3565; Pricing 1: 1=4.15, 25=2.75, 100=2.07 (USD); Packaging: Tube; Part Status: Active; Voltage - Output: 5V; Operating Temperature: -40°C ~ 125°C; Mounting Type: Surface Mount; Package / Case: 8-SOIC (0.154", 3.90mm Width); Supplier Device Package: 8-SOIC; ComponentLink1URL: http://www.linear.com/docs/3903; ComponentLink1Description: http://www.linear.com/docs/3903
U12 = CCG302412S: DC/DC CONVERTER 12V 2.5A PCB; Power (Watts) - Manufacture Series: 30W; Manufacturer 1: TDK-Lambda Americas Inc; Number of Outputs: 1; Voltage - Input (Min): 9V; Voltage - Input (Max): 36V; Voltage - Isolation: 1.5kV (1500V); Efficiency: 89%; Category 1: Power Supplies - Board Mount; Packaging: Tube; Type: Isolated Module; Voltage - Output 1: 12V; Voltage - Output 2: -; Voltage - Output 3: -; Current - Output (Max): 2.5A; Features: Remote On/Off, OCP; Mounting Type: Through Hole; Package / Case: 6-DIP Module (6 Leads); Size / Dimension: 1.00" L x 1.00" W x 0.39" H (25.4mm x 25.4mm x 9.9mm); Operating Temperature: -40°C ~ 85°C; Power (Watts) - Max: 30W; ComponentLink1URL: http://www.us.tdk-lambda.com/ftp/specs/ccg30.pdf; ComponentLink1Description: http://www.us.tdk-lambda.com/ftp/specs/ccg30.pdf; Supplier 1: Digi-Key; Supplier Part Number 1: 285-2419-ND; Manufacturer Part Number 1: CCG302412S; RoHS 1: RoHS Compliant; Description 1: DC/DC CONVERTER 12V 2.5A PCB; Stock 1: 30; Pricing 1: 1=43.63, 10=42.95 (USD)
U13 = CMP-1310-00373-1: Low Voltage, Rail-to-Rail Output Operational Amplifier, 1.7 to 5.5 V, -40 to 85 degC, 5-Pin SOT-553, Pb-Free, Tape and Reel; Manufacturer: On Semiconductor; VCC Min (V): 1.7; VCC Max (V): 5.5; ComponentLink1Description: Manufacturer URL; Mounting Technology: Surface Mount; ComponentLink1URL: http://www.onsemi.com/; Packing: Tape and Reel; PackageReference: SOT-553-5-463B; PartNumber: NCS2003XV53T2G; PackageDescription: 5-Pin Small Outline Transistor, Body 1.6 x 1.2 mm, Pitch 0.5 mm; PackageVersion: Rev. C, 03/2013; RoHS: TRUE; ComponentLink2URL: http://www.onsemi.cn/pub_link/Collateral/NCS2003-D.PDF; ComponentLink3URL: http://www.onsemi.com/pub_link/Collateral/463B-01.PDF; ComponentLink3Description: Package Specification; DatasheetVersion: Rev. 3; ComponentLink2Description: Datasheet
U15 = CMP-0272-00241-3: 0.03 uV/degC, 6 uV Vos, Low Noise, Rail-to-Rail Output, Zero-Drift Operational Amplifier, 4 to 36 V, -40 to 105 degC, 8-pin SOIC (D8), Green (RoHS & no Sb/Br); Manufacturer: Texas Instruments; Number of Circuits: 2; Slew Rate: 0.8 V/µs; Current - Supply: 415µA; Current - Output / Channel: 18mA; Voltage - Supply, Single/Dual (±): 4 V ~ 36 V, ±2 V ~ 18 V; Supplier 1: Digi-Key; Supplier Part Number 1: 296-29454-6-ND; Manufacturer Part Number: OPA2188AIDR; RoHS: RoHS Compliant; Category: Integrated Circuits (ICs); Stock 1: 8272; Pricing 1: 1=3.44, 10=3.089, 100=2.5307, 500=2.15434, 1000=1.81692 (USD); Packaging: Digi-Reel®; Part Status: Active; Amplifier Type: Zero-Drift; Output Type: Rail-to-Rail; -3db Bandwidth: -; Operating Temperature: -40°C ~ 105°C; Mounting Type: Surface Mount; Package / Case: 8-SOIC (0.154", 3.90mm Width); Supplier Device Package: 8-SOIC; ComponentLink1URL: http://www.ti.com/lit/ds/symlink/opa2188.pdf; ComponentLink1Description: http://www.ti.com/lit/ds/symlink/opa2188.pdf
U17#1 U17#2 = CMP-0272-00234-3: 0.03 uV/degC, 6 uV Vos, Low Noise, Rail-to-Rail Output, Zero-Drift Operational Amplifier, 4 to 36 V, -40 to 105 degC, 8-pin SOIC (D8), Green (RoHS & no Sb/Br); Manufacturer: Texas Instruments; CMRR(Min)(dB): 120; Number of Channels: 2; Sub Family: High Supply Voltage Amplifier (>=30V), Low Noise Amp (<=10nV/rtHz), Low Offset Voltage Amplifier (<=500uV), Low Power Amp (<=500uA), Precision Amplifier, Zero Drift Precision Amplifier; Slew Rate(Typ)(V/us): 0.8; Rating: Catalog; Vio (25C)(Max)(mV): 0.025; Iq per channel(Max)(mA): 0.475; IIB(Max)(pA): 850; Offset Drift(Typ)(uV/C): 0.03; Total Supply Voltage(Min)(+5V is 5, +/-5V is 10): 4; Total Supply Voltage(Max)(+5V is 5, +/-5V is 10): 36; Packing: TUBE; Eco-Plan: Green (RoHS & no Sb/Br); PackageReference: D0008A; ComponentLink3Description: Package Specification; PartNumber: OPA2188AID; GBW(Typ)(MHz): 2; DatasheetVersion: SBOS525B; PackageVersion: 4040047-3/M, 06/2011; Mounting Technology: Surface Mount; ComponentLink1Description: Manufacturer URL; PackageDescription: 8-Pin Plastic Small Outline, Body 4.9 x 3.9 mm, Pitch 1.27 mm; ComponentLink2Description: Datasheet; ComponentLink2URL: http://www.ti.com/lit/ds/symlink/opa2188.pdf; Code_JEDEC: MS-012; ComponentLink1URL: http://www.ti.com/; ComponentLink3URL: http://www.ti.com/litv/pdf/msoi002j; PartId: 1
U18 = CMP-0254-00374-1: +/-5ppm, I2C Real-Time Clock with Internal MEMs Resonator, 8-Pin SO, -40 to 85 degC, Automotive Qualified, Pb-Free; PackageDescription: 8-Pin Small-Outline IC, Narrow (0.15in), 1.27 mm Pitch, SOIC (N), Pb-Free; PackageVersion: revC, 2010; PackageReference: S8MK+1; ComponentLink1URL: http://www.maxim-ic.com; ComponentLink3Description: Package Specification; DatasheetVersion: Rev 3, Dec-2011; ComponentLink3URL: http://pdfserv.maxim-ic.com/package_dwgs/21-0041.PDF; ComponentLink1Description: Manufacturer URL; Code_JEDEC: MS-012-AA; ComponentLink2Description: Datasheet; Code_IPC: SOIC127P600-8; ComponentLink2URL: http://datasheets.maxim-ic.com/en/ds/DS3231M.pdf
U19 = Beaglebone_Black: Beaglebone Black